# Altium schematic sheet SMD8x10.2.schdoc
size 48 x 29 mm
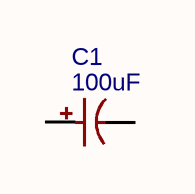
[diagram p0: SMD8x10.2.schdoc]

## Parts
C1  100uF  [CAP-SMD_BD8.0-L8.3-W8.3-FD]

## Nets

Not connected (* = marked no-connect by the designer): C1 1 2

## Library data of the parts
C1 = 100uF: BOM_Manufacturer: HONOR; BOM_Manufacturer Part: RVT1H101M0810; nameAlias: Capacitance; BOM_Supplier: LCSC; BOM_Supplier Part: C3352; spicePre: C; spiceSymbolName: RVT1H101M0810